# Altium schematic sheet PRIMARY_POWER.SchDoc
size A; SheetNumber: 6; SheetTotal: 21
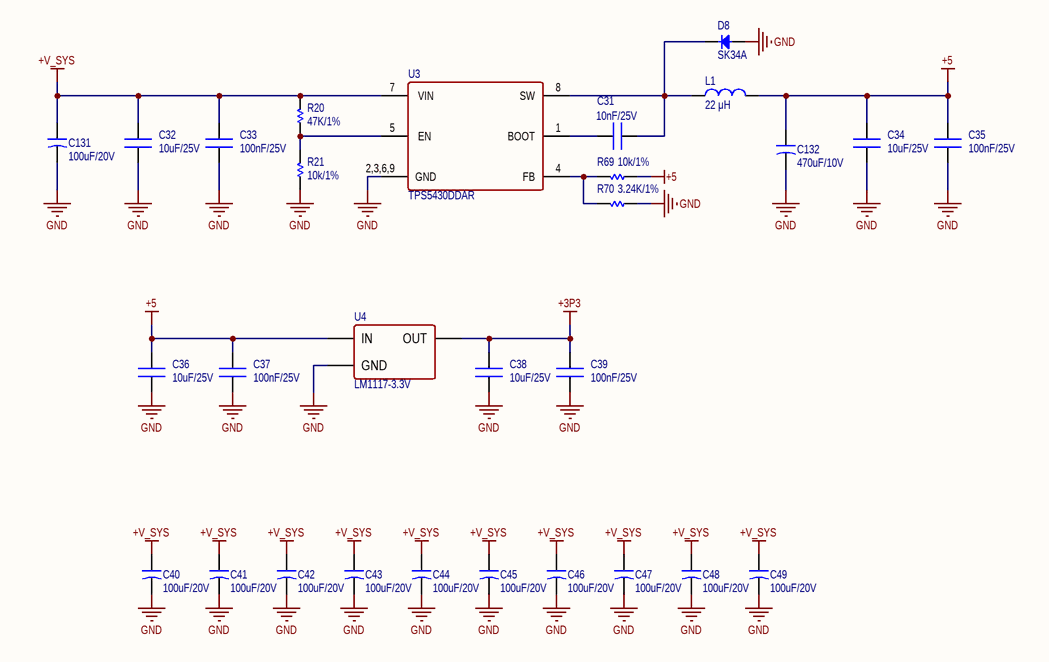
[diagram p0: PRIMARY_POWER.SchDoc]

## Parts
C31  10nF/25V  [CN-SMD-0603]
C32  10uF/25V  [CN-SMD-0603]
C33  100nF/25V  [CN-SMD-0603]
C34  10uF/25V  [CN-SMD-0603]
C35  100nF/25V  [CN-SMD-0603]
C36  10uF/25V  [CN-SMD-0603]
C37  100nF/25V  [CN-SMD-0603]
C38  10uF/25V  [CN-SMD-0603]
C39  100nF/25V  [CN-SMD-0603]
C40  100uF/20V  [Tantalum 2917]
C41  100uF/20V  [Tantalum 2917]
C42  100uF/20V  [Tantalum 2917]
C43  100uF/20V  [Tantalum 2917]
C44  100uF/20V  [Tantalum 2917]
C45  100uF/20V  [Tantalum 2917]
C46  100uF/20V  [Tantalum 2917]
C47  100uF/20V  [Tantalum 2917]
C48  100uF/20V  [Tantalum 2917]
C49  100uF/20V  [Tantalum 2917]
C131  100uF/20V  [Tantalum 2917]
C132  470uF/10V  [Tantalum 2917]
D8  SK34A  [DIO-SMD-A]
L1  22 μH  [PSM6050]
R20  47K/1%  [RES-SMD-0603]
R21  10k/1%  [RES-SMD-0603]
R69  10k/1%  [RES-SMD-0603]
R70  3.24K/1%  [RES-SMD-0603]
U3  TPS5430DDAR  [HSOP8]
U4  LM1117-3.3V  [SOT223]

## Nets
+3P3: C38.2 C39.2 U4.2,4(OUT)
+5: C34.2 C35.2 C36.2 C37.2 C132.1 L1.2 R69.1 U4.3(IN)
+V_SYS: C32.2 C33.2 C40.1 C41.1 C42.1 C43.1 C44.1 C45.1 C46.1 C47.1 C48.1 C49.1 C131.1 R20.2 U3.7(VIN)
GND: C32.1 C33.1 C34.1 C35.1 C36.1 C37.1 C38.1 C39.1 C40.2 C41.2 C42.2 C43.2 C44.2 C45.2 C46.2 C47.2 C48.2 C49.2 C131.2 C132.2 D8.1(A) R21.1 R70.1 U3.2,3,6,9(GND) U4.1(GND)
NetC31_1: C31.1 D8.2(K) L1.1 U3.8(SW)
NetC31_2: C31.2 U3.1(BOOT)
NetR20_1: R20.1 R21.2 U3.5(EN)
NetR69_2: R69.2 R70.2 U3.4(FB)

## Library data of the parts
C31 = CN: CL10B103KB8NNNC; PN: CL10B103KB8NNNC
C32 C34 C36 C38 = CN: 0603W106M250XD; PN: 0603W106M250XD
C33 C35 C37 C39 = CN: CL10B104KA8NNNC; PN: CL10B104KA8NNNC
C40-C49 C131 = CN-SMD: TAJD107K020RNJ; PN: TAJD107K020RNJ; LatestRevisionDate: 17-Jul-2002; LatestRevisionNote: Re-released for DXP Platform.; PackageReference: POLAR0.8; Publisher: Altium Limited
C132 = CN-SMD: TAJE477K010RNJ; PN: TAJE477K010RNJ; LatestRevisionDate: 17-Jul-2002; LatestRevisionNote: Re-released for DXP Platform.; PackageReference: POLAR0.8; Publisher: Altium Limited
D8 = Diode SMD: Code - JEDEC: DO-214-AB; Published: 8-Jun-2000; Revision: July-2002: Re-released for DXP Platform.; Publisher: Altium Limited; PN: SK34A
L1 = L-SMD-1: FIXED IND 22UH 2.5A 170 MOHM SMD, P/N: SRP7050TA-220M; Manufacturer: Wurth Elektronik; PN: SRP7050TA-220M; Inductance: 22 μH; ComponentLink1Description: Manufacturer; ComponentLink1URL: http://www.we-online.de; Created by: Baojun Chen; Created Date: Nov.2015; ComponentLink2Description: Datasheet; ComponentLink2URL: http://katalog.we-online.de/pbs/datasheet/78477010.pdf
R20 = Res-SMD: ERJ-3EKF4702V; Manufacturer: Generic Components; Class: Passive; PN: ERJ-3EKF4702V; Publisher: Altium Hobart Technology Centre
R21 R69 = Res-SMD: ERJ-3EKF1002V; Manufacturer: Generic Components; Class: Passive; PN: ERJ-3EKF1002V; Publisher: Altium Hobart Technology Centre
R70 = Res-SMD: ERJ-3EKF3241V; Manufacturer: Generic Components; Class: Passive; PN: ERJ-3EKF3241V; Publisher: Altium Hobart Technology Centre
U3 = TPS5430: IC REG BUCK ADJ 3A 8SOPWR, P/N: TPS5430DDAR; PN: TPS5430DDAR
U4 = LM1117: TLV1117-33IDCYR; PN: TLV1117-33IDCYR; Website: http://group3i.net